# EAGLE design LoRa_RN5 (EAGLE 7.2.0)
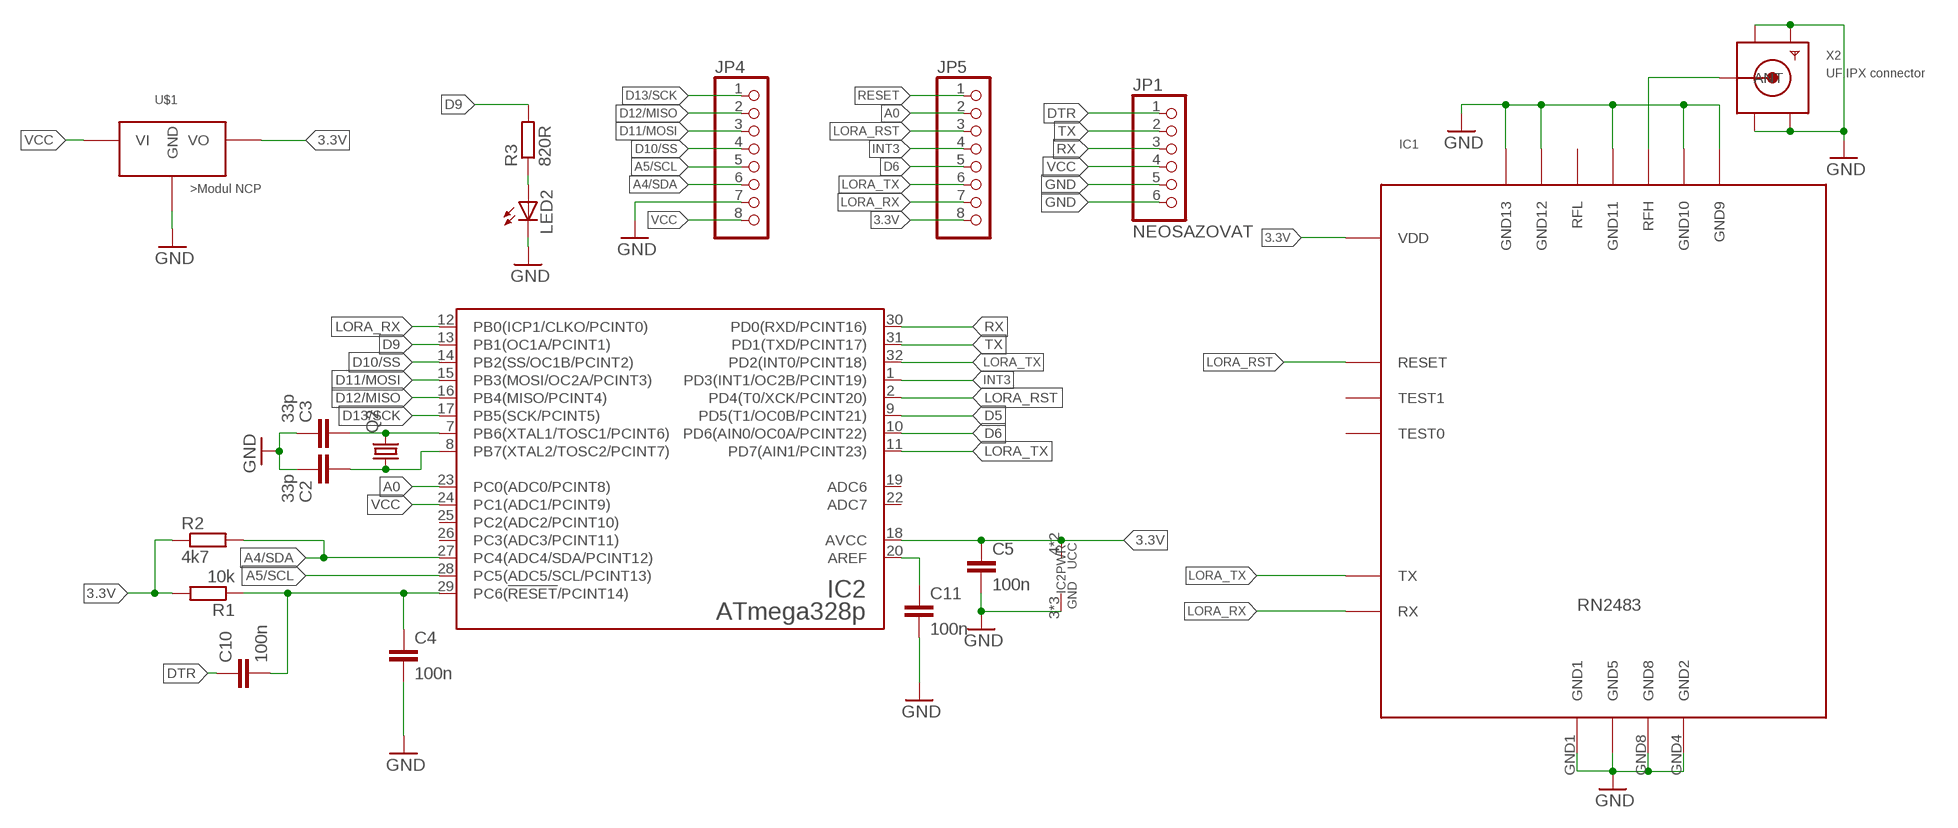
[diagram p0: schematic, sheet 1]

## Parts
C2  33p  C-EUC0805  [C0805]
C3  33p  C-EUC0805  [C0805]
C4  100n  C-EUC0805  [C0805]
C5  100n  C-EUC0805  [C0805]
C10  100n  C-EUC0805  [C0805]
C11  100n  C-EUC0805  [C0805]
IC1  RN2483_MIN  [RN2483_2]
IC2  ATmega328p  ATMEGA48/88/168/328-AU  [TQFP32-08]
JP1  NEOSAZOVAT  PINHD-1X6  [1X06]
JP4  PINHD-1X8  [1X08]
JP5  PINHD-1X8  [1X08]
LED2  LEDCHIPLED_1206  [CHIPLED_1206]
Q2  CRYSTALCTS406  [CTS406]
R1  10k  R-EU_R0805  [R0805]
R2  4k7  R-EU_R0805  [R0805]
R3  820R  R-EU_R0805  [R0805]
U$1  NEOSAZOVAT  MOD_NCP1402  [MOD_NCP1402]
X2  UF.IPX connector  SMACONNECTOR_EDGE_UFL  [SMA_EDGELAUNCH_UFL]

## Nets
3.3V: C5.1 IC1.VDD IC2.4(UCC) IC2.6(UCC) IC2.18(AVCC) JP5.8 R1.2 R2.1 U$1.VO
A0: IC2.23(PC0(ADC0/PCINT8)) JP5.2
A4/SDA: IC2.27(PC4(ADC4/SDA/PCINT12)) JP4.6 R2.2
A5/SCL: IC2.28(PC5(ADC5/SCL/PCINT13)) JP4.5
D5: IC2.9(PD5(T1/OC0B/PCINT21))
D6: IC2.10(PD6(AIN0/OC0A/PCINT22)) JP5.5
D9: IC2.13(PB1(OC1A/PCINT1)) R3.2
D10/SS: IC2.14(PB2(SS/OC1B/PCINT2)) JP4.4
D11/MOSI: IC2.15(PB3(MOSI/OC2A/PCINT3)) JP4.3
D12/MISO: IC2.16(PB4(MISO/PCINT4)) JP4.2
D13/SCK: IC2.17(PB5(SCK/PCINT5)) JP4.1
DTR: C10.1 JP1.1
GND: C2.1 C3.1 C4.2 C5.2 C11.2 IC1.GND1 IC1.GND4(GND2) IC1.GND5 IC1.GND8 IC1.GND9 IC1.GND10 IC1.GND11 IC1.GND12 IC1.GND13 IC2.3(GND) IC2.5(GND) IC2.21(GND) JP1.5 JP1.6 JP4.7 LED2.C U$1.GND X2.GND@1(GND1) X2.GND@2(GND2) X2.GND@3(GND3) X2.GND@4(GND4)
INT3: IC2.1(PD3(INT1/OC2B/PCINT19)) JP5.4
LORA_RST: IC1.RESET IC2.2(PD4(T0/XCK/PCINT20)) JP5.3
LORA_RX: IC1.RX IC2.12(PB0(ICP1/CLKO/PCINT0)) JP5.7
LORA_TX: IC1.TX IC2.11(PD7(AIN1/PCINT23)) IC2.32(PD2(INT0/PCINT18)) JP5.6
N$1: IC1.RFH X2.P(ANT)
N$2: C2.2 IC2.8(PB7(XTAL2/TOSC2/PCINT7)) Q2.1
N$3: C3.2 IC2.7(PB6(XTAL1/TOSC1/PCINT6)) Q2.3
N$4: LED2.A R3.1
N$5: C11.1 IC2.20(AREF)
RESET: C4.1 C10.2 IC2.29(PC6(!RESET!/PCINT14)) JP5.1 R1.1
RX: IC2.30(PD0(RXD/PCINT16)) JP1.3
TX: IC2.31(PD1(TXD/PCINT17)) JP1.2
VCC: IC2.24(PC1(ADC1/PCINT9)) JP1.4 JP4.8 U$1.VI
Unconnected: IC1.RFL IC1.TEST0 IC1.TEST1 IC2.19(ADC6) IC2.22(ADC7) IC2.25(PC2(ADC2/PCINT10)) IC2.26(PC3(ADC3/PCINT11))

## Library data of the parts
C2-C5 C10 C11 = rcl:C-EU: CAPACITOR, European symbol
IC1 = RN2483:RN2483_MIN
IC2 = atmel_tiny24-44-84tiny48-88mega48-88-168-328:ATMEGA48/88/168/328
JP1 = pinhead:PINHD-1X6: PIN HEADER
JP4 JP5 = pinhead:PINHD-1X8: PIN HEADER
LED2 = led:LED: LED OSRAM: - CHIPLED LG R971, LG N971, LY N971, LG Q971, LY Q971, LO R971, LY R971 LH N974, LH R974 LS Q976, LO Q976, LY Q976 LO Q996 - Hyper CHIPLED LW Q18S LB Q993, LB Q99A, LB R99A - SideLED LS A670, LO A670, LY A670, LG A670, LP A670 LB A673, LV A673, LT A673, LW A673 LH A674 LY A675 LS A676, LA A676, LO A676, LY A676, LW A676 LS A679, LY A679, LG A679 - Hyper Micro SIDELED® LS Y876, LA Y876, LO Y876, LY Y876 LT Y87S - SmartLED LW L88C, LW L88S LB L89C, LB L89S, LG L890 LS L89K, LO L89K, LY L89K LS L896, LA L896, LO L896, LY L896 - TOPLED LS T670, LO T670, LY T670, LG T670, LP T670 LSG T670, LSP T670, LSY T670, LOP T670, LYG T670 LG T671, LOG T671, LSG T671 LB T673, LV T673, LT T673, LW T673 LH T674 LS T676, LA T676, LO T676, LY T676, LB T676, LH T676, LSB T676, LW T676 LB T67C, LV T67C, LT T67C, LS T67K, LO T67K, LY T67K, LW E67C LS E67B, LA E67B, LO E67B, LY E67B, LB E67C, LV E67C, LT E67C LW T67C LS T679, LY T679, LG T679 LS T770, LO T770, LY T770, LG T770, LP T770 LB T773, LV T773, LT T773, LW T773 LH T774 LS E675, LA E675, LY E675, LS T675 LS T776, LA T776, LO T776, LY T776, LB T776 LHGB T686 LT T68C, LB T68C - Hyper Mini TOPLED® LB M676 - Mini TOPLED Santana® LG M470 LS M47K, LO M47K, LY M47K Source: http://www.osram.convergy.de LUXEON: - LUMILED® LXK2-PW12-R00, LXK2-PW12-S00, LXK2-PW14-U00, LXK2-PW14-V00 LXK2-PM12-R00, LXK2-PM12-S00, LXK2-PM14-U00 LXK2-PE12-Q00, LXK2-PE12-R00, LXK2-PE12-S00, LXK2-PE14-T00, LXK2-PE14-U00 LXK2-PB12-K00, LXK2-PB12-L00, LXK2-PB12-M00, LXK2-PB14-N00, LXK2-PB14-P00, LXK2-PB14-Q00 LXK2-PR12-L00, LXK2-PR12-M00, LXK2-PR14-Q00, LXK2-PR14-R00 LXK2-PD12-Q00, LXK2-PD12-R00, LXK2-PD12-S00 LXK2-PH12-R00, LXK2-PH12-S00 LXK2-PL12-P00, LXK2-PL12-Q00, LXK2-PL12-R00 Source: www.luxeon.com KINGBRIGHT: KA-3528ASYC Source: www.kingbright.com
Q2 = crystal:CRYSTAL: CRYSTAL; OC_FARNELL: unknown; OC_NEWARK: unknown
R1-R3 = rcl:R-EU_: RESISTOR, European symbol
U$1 = MOJE_NB:MOD_NCP1402
X2 = adafruit:SMACONNECTOR: SMA Connector 90° DIP SMA Connector, 50 Ohm (4UConnector: 07259)

## Board
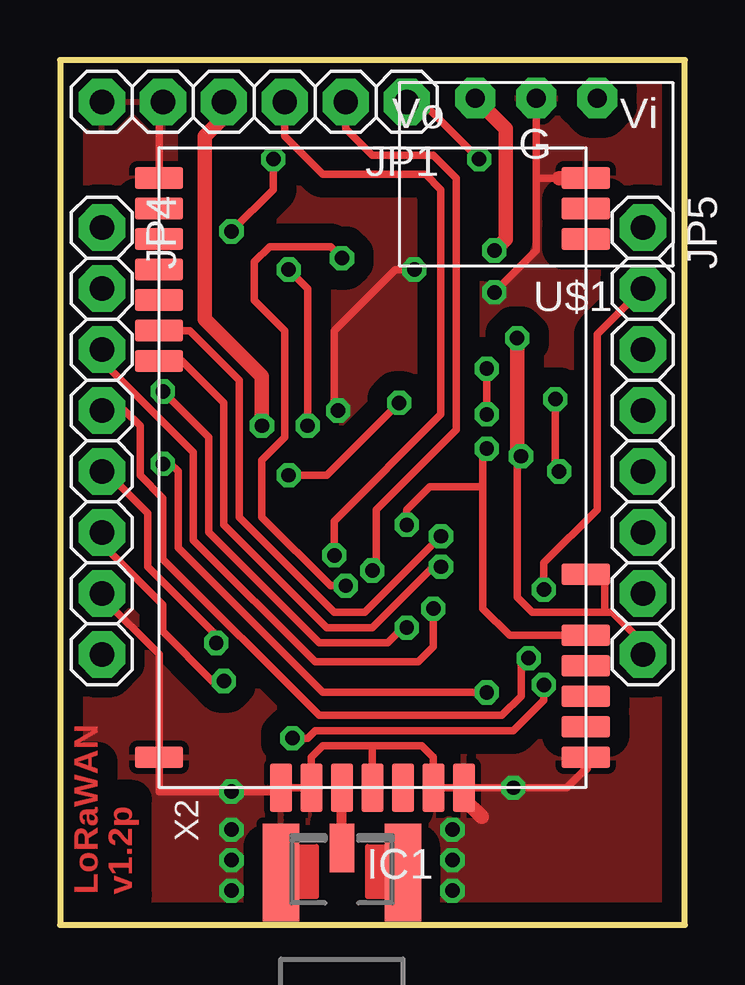
[diagram p1: board, top side]
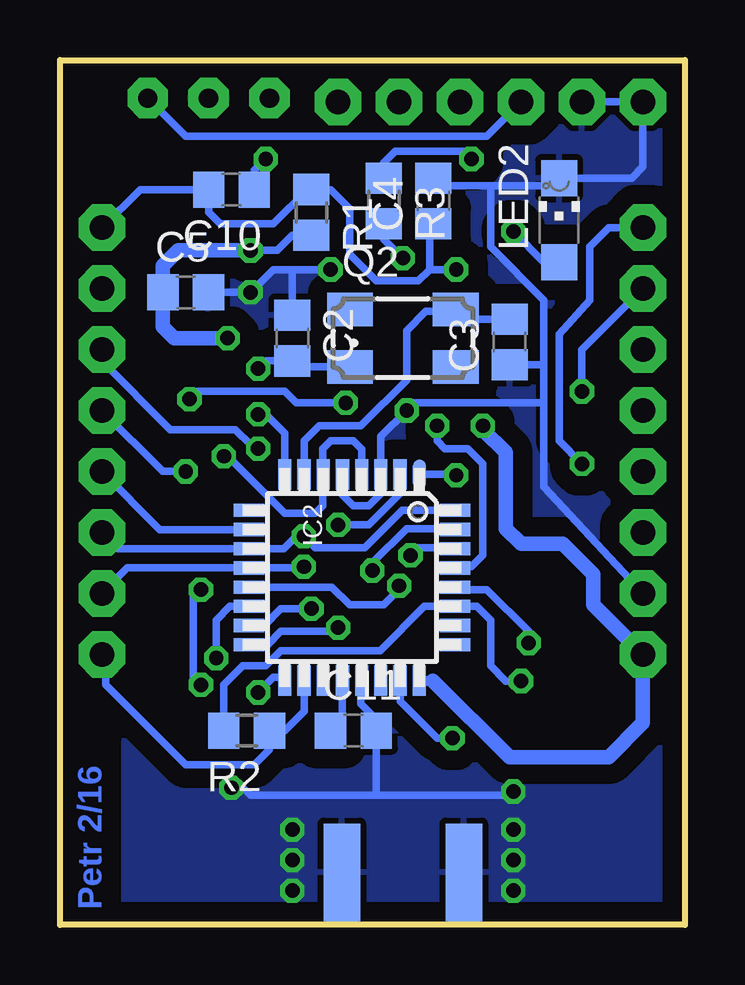
[diagram p2: board, bottom side, seen from below]

Size 26.03 x 36.04 mm. Coordinates in mm from the lower left corner, seen from the top.
Outline: 0,36.04 0,0 26.04,0 26.04,36.04 0,36.04
Copper layers (1*16): Top 0.035mm / dielectric 1.5mm / Bottom 0.035mm
Design rules "default *": minimum track width 6mil, minimum drill 10mil, track to track 6mil, track to pad 6mil, pad to pad 6mil, via to via 6mil, smd to smd 6mil, copper to edge 20mil, drill to drill 6mil, minimum pad ring 10mil, minimum via ring 8mil, stop-mask expansion 4mil, vias tented up to drill 0mil, thermal gap 10mil

### Footprints (pad centres in the part's own frame; a part is rotated, then mirrored left to right if it is on the bottom)
C0805 = smd 1.3 x 1.5: 1 -0.95,0; 2 0.95,0
RN2483_2 = smd 2 x 0.9: CTS 8.89,-10.16; GND1 -8.89,11.43; GND4 -8.89,-12.7; GND5 8.89,-12.7; GND8 8.89,11.43; GPIO8 -8.89,-10.16; GPIO9 -8.89,-11.43; NC1 -8.89,10.16; RESET -8.89,6.35; RSV1 8.89,-8.89; RSV2 8.89,-7.62; RTS 8.89,-11.43; RX 8.89,-5.08; TEST0 -8.89,8.89; TEST1 -8.89,7.62; TX 8.89,-6.35; VDD -8.89,3.81 | smd 0.9 x 2: GND9 3.81,12.7; GND10 2.54,12.7; GND11 0,12.7; GND12 -2.54,12.7; GND13 -3.81,12.7; RFH 1.27,12.7; RFL -1.27,12.7
TQFP32-08 = smd 1.27 x 0.55: 1 -4.293,2.8; 2 -4.293,2; 3 -4.293,1.2; 4 -4.293,0.4; 5 -4.293,-0.4; 6 -4.293,-1.2; 7 -4.293,-2; 8 -4.293,-2.8; 17 4.293,-2.8; 18 4.293,-2; 19 4.293,-1.2; 20 4.293,-0.4; 21 4.293,0.4; 22 4.293,1.2; 23 4.293,2; 24 4.293,2.8 | smd 0.55 x 1.27: 9 -2.8,-4.293; 10 -2,-4.293; 11 -1.2,-4.293; 12 -0.4,-4.293; 13 0.4,-4.293; 14 1.2,-4.293; 15 2,-4.293; 16 2.8,-4.293; 25 2.8,4.293; 26 2,4.293; 27 1.2,4.293; 28 0.4,4.293; 29 -0.4,4.293; 30 -1.2,4.293; 31 -2,4.293; 32 -2.8,4.293
1X06 = drill 1.016 pad 1.93 octagon: 1 -6.35,0; 2 -3.81,0; 3 -1.27,0; 4 1.27,0; 5 3.81,0; 6 6.35,0
1X08 = drill 1.016 pad 1.93 octagon: 1 -8.89,0; 2 -6.35,0; 3 -3.81,0; 4 -1.27,0; 5 1.27,0; 6 3.81,0; 7 6.35,0; 8 8.89,0
CHIPLED_1206 = smd 1.5 x 1.5: A 0,-1.75; C 0,1.75
CTS406 = smd 1.9 x 1.4: 1 -2.2,-1.2; 2 2.2,-1.2; 3 2.2,1.2; 4 -2.2,1.2
R0805 = smd 1.3 x 1.5: 1 -0.95,0; 2 0.95,0
MOD_NCP1402 = drill 0.8 pad 1.676 octagon: GND 0,0; VI -2.54,0; VO 2.54,0
SMA_EDGELAUNCH_UFL = smd 4.064 x 1.524: GND@1 2.032,-2.54; GND@2 2.032,2.54 | smd 4.064 x 1.524 bottom: GND@3 2.032,2.54; GND@4 2.032,-2.54 | smd 2.032 x 1.016: P 3.048,0

### Placement (x,y rotation side)
C2  16.35,24.45 270 bottom
C3  7.3,24.29 90 bottom
C4  10.48,30.16 90 bottom
C5  20.8,26.35 0 bottom
C10  18.89,30.64 180 bottom
C11  13.81,8.1 0 bottom
IC1  13.02,18.41 180 top
IC2  13.87,14.47 270 bottom
JP1  8.1,34.29 180 top
JP4  1.75,20.16 270 top
JP5  24.29,20.16 270 top
LED2  5.24,29.37 0 bottom
Q2  11.75,24.45 0 bottom
R1  15.56,29.69 270 bottom
R2  18.26,8.1 180 bottom
R3  12.54,30.16 270 bottom
U$1  19.84,34.45 180 top
X2  11.75,0.16 90 top

### Tracks (layer width: path | path; a pad name or v marks a point on that pad's centre or on a via)
3.3V  (via drill 0.6)
  Top 0.305: IC1.VDD 21.91,14.29 22.54,14.29 22.7,14.45 22.7,13.02 | JP5.8 24.29,11.75 23.02,13.02 22.7,13.02 | 22.7,13.02 19.69,13.02 19.05,13.65 19.05,19.37 v19.21,19.53
  Top 0.61: v19.05,24.45 19.05,19.68 v19.21,19.53 | U$1.VO 18.57,33.18 18.57,28.57 v18.1,28.1
  Bottom 0.305: JP5.8 24.13,11.11 24.13,10 20.8,6.67 17.94,6.67 17.31,7.3 R2.1 16.67,8.1 15.87,8.9 IC2.18 | R1.2 16.35,28.74 16.99,28.1 v18.1,28.1 | IC2.4 13.47,19.82 13.81,20.16 14.76,20.16 15.08,19.84 15.08,18.78 IC2.6 15.08,18.75 15.08,17.46 15.4,17.14 16.67,17.14 18.73,19.21 19.05,19.53 v19.21,19.53 | C5.1
  Bottom 0.61: v18.1,28.1 21.11,28.1 21.75,27.46 C5.1 | v19.05,24.45 21.27,24.45 21.75,24.92 C5.1
A0  (via drill 0.6)
  Top 0.305: v20.16,10 20.16,9.37 18.89,8.1 10.64,8.1 10.32,7.78 v9.68,7.78 | v20.16,13.97 20.16,15.08 22.38,17.3 22.38,24.61 JP5.2
  Bottom 0.305: IC2.23 11.87,9.33 10.32,7.78 v9.68,7.78 | v20.16,10 20.48,10.32 20.48,13.65 v20.16,13.97
A4/SDA  (via drill 0.6)
  Top 0.305: JP4.6 1.75,15.87 4.29,13.33 4.29,12.22 6.35,10.16 v6.83,10.16
  Bottom 0.305: R2.2 19.21,8.42 19.21,10 18.42,10.79 17.46,10.79 16.83,11.43 12.7,11.43 10.86,13.27 IC2.27 8.67,13.27 8.1,12.7 8.1,10.79 7.46,10.16 v6.83,10.16
A5/SCL  (via drill 0.6)
  Top 0.305: JP4.5 1.91,18.89 3.65,17.14 3.65,14.92 6.51,12.06 v6.51,11.75
  Bottom 0.305: IC2.28 9.47,13.97 8.26,13.97 6.51,12.22 v6.51,11.75
D6
  Bottom 0.305: IC2.10 21.87,16.47 JP5.5
D9  (via drill 0.6)
  Top 0.305: v11.91,14.13 11.27,14.13 8.41,16.99 8.41,19.37 9.37,20.32 9.37,24.76 8.1,26.03 8.1,27.62 8.73,28.26 11.27,28.26 v11.75,27.78
  Bottom 0.305: R3.2 12.54,28.57 v11.75,27.78 | v11.91,14.13 11.96,14.07 11.96,13.91 12.54,13.33 13.97,13.33 14.71,14.07 IC2.13
D10/SS  (via drill 0.6)
  Top 0.305: v19.53,11.11 19.21,10.79 19.21,9.52 18.42,8.73 10.8,8.73 4.29,15.24 4.29,17.78 3.33,18.73 3.33,20.8 2.7,21.43 JP4.4
  Bottom 0.305: IC2.14 18.95,13.27 19.53,12.7 v19.53,11.11 19.46,11.21
D11/MOSI  (via drill 0.6)
  Top 0.305: v15.56,13.18 15.56,11.59 14.92,10.95 10.64,10.95 5.56,16.03 5.56,19.68 1.75,23.49 JP4.3
  Bottom 0.305: IC2.15 17.53,12.47 16.83,13.18 v15.56,13.18
D12/MISO  (via drill 0.6)
  Top 0.305: v14.45,12.38 14.29,12.38 13.65,11.75 10.8,11.75 6.19,16.35 6.19,20.32 v4.29,22.22
  Bottom 0.305: IC2.16 17.38,11.67 16.83,12.22 14.61,12.22 v14.45,12.38 | v4.29,22.22 4.29,23.97 JP4.2
D13/SCK  (via drill 0.6)
  Top 0.305: v17.78,9.68 10.95,9.68 4.92,15.72 4.92,18.89 4.6,19.21 v4.29,19.21
  Bottom 0.305: IC2.17 16.67,10.32 | 16.67,10.32 | 16.67,10.32 17.15,10.32 v17.78,9.68 | JP4.1 3.18,29.05 3.97,28.26 3.97,26.03 5.24,24.61 5.24,20.16 v4.29,19.21
DTR  (via drill 0.6)
  Top 0.305: JP1.1 15.08,34.29 v17.46,31.91
  Bottom 0.305: v17.46,31.91 17.94,31.43 C10.1
GND  (via drill 0.6)
  Top 0.305: 21.91,6.51 21.11,5.71 v18.89,5.71 IC1.GND13 IC1.GND12 15.56,6.98 15.08,7.46 13.02,7.46 | v14.76,27.3 13.97,27.3 11.43,24.76 11.43,21.59 v11.59,21.43 | IC1.GND11 13.02,7.46 | 13.02,7.46 10.95,7.46 10.48,6.98 IC1.GND10 IC1.GND9 9.05,5.56 v7.14,5.56 4.13,5.56 4.13,7.14 | U$1.GND 19.84,31.11 | 19.84,31.11 19.84,28.1 v18.1,26.35 | IC1.GND5 4.13,34.13 JP1.5 | JP4.7 1.75,13.65 4.13,11.27 4.13,7.14 | 4.13,7.14 4.29,7.14 IC1.GND8 | 20.8,31.11 19.84,31.11
  Top 0.406: 21.91,6.51 IC1.GND1 | IC1.GND11 13.12,5.71
  Top 0.61: 17.57,4.5 16.83,5.24 IC1.GND13 | 10.48,5.08 IC1.GND10 | IC1.GND4 20.8,31.11
  Bottom 0.305: 5.87,21.75 5.87,23.34 | 5.87,23.34 5.87,26.03 8.1,28.26 8.1,30.8 | IC2.21 13.49,10.15 13.49,9.21 12.86,8.57 C11.2 12.86,6.19 12.86,5.4 | C5.2 18.26,26.35 18.1,26.51 v18.1,26.35 17.15,27.3 16.35,27.3 | 8.1,30.8 9.84,30.8 C4.2 | IC2.5 14.27,17.92 13.81,17.46 13.18,17.46 12.7,17.94 12.7,18.73 IC2.3 12.67,20.35 v11.59,21.43 11.27,21.75 5.87,21.75 | 5.87,21.75 5.87,18.26 JP4.7 | 12.86,5.4 7.3,5.4 v7.14,5.56 | v18.89,5.71 18.42,5.71 18.1,5.4 12.86,5.4 | JP1.5 JP1.6 1.75,31.59 2.22,31.12 LED2.C 5.72,30.8 8.1,30.8 | v14.76,27.3 16.35,27.3 | C3.1 6.19,23.34 5.87,23.34 | C2.1 16.35,27.3
  other vias: 7.14,3.97 7.14,2.7 7.14,1.43 16.35,1.43 16.35,2.7 16.35,3.97
  pour Bottom (isolate 0.813): -0.48,36.35 26.35,36.35 26.35,-0.32 -0.48,-0.32
  pour Top (isolate 0.813): -0.48,36.51 26.51,36.51 26.51,-0.32 -0.48,-0.32
INT3  (via drill 0.6)
  Top 0.305: v9.53,18.73 11.11,18.73 v14.13,21.75 | v20.64,21.91 20.64,19.05 v20.8,18.89
  Bottom 0.305: JP5.4 21.75,18.89 v20.8,18.89 | v14.13,21.75 16.19,21.75 16.67,22.22 20.32,22.22 v20.64,21.91 | IC2.1 9.56,18.77 v9.53,18.73
LORA_RST  (via drill 0.6)
  Top 0.305: v14.45,16.67 14.45,17.3 15.4,18.26 17.62,18.26 | 17.62,18.26 17.62,13.18 18.73,12.06 IC1.RESET | v17.78,19.84 17.62,19.68 17.62,18.26
  Bottom 0.305: JP5.3 24.29,23.49 21.43,20.64 18.73,20.64 18.1,20 17.78,20 v17.78,19.84 | IC2.2 11.87,17.98 13.18,16.67 v14.45,16.67
LORA_RX  (via drill 0.6)
  Top 0.305: IC1.RX 5.08,23.49 6.83,21.75 6.83,16.67 11.11,12.38 13.02,12.38 15.56,14.92 v15.88,14.92
  Bottom 0.305: JP5.7 23.23,14.87 IC2.12 15.92,14.87 v15.88,14.92
LORA_TX  (via drill 0.6)
  Top 0.305: IC1.TX 5.4,24.76 7.46,22.7 7.46,16.99 11.43,13.02 12.7,13.02 v15.88,16.19
  Bottom 0.305: JP5.6 23.61,15.67 IC2.11 16.71,15.67 16.19,16.19 v15.88,16.19 15.4,15.72 13.34,15.72 11.78,17.27 IC2.32
N$1
  Top 0.406: X2.P IC1.RFH
N$2  (via drill 0.6)
  Top 0.305: v17.78,21.27 v17.78,23.18
  Bottom 0.305: Q2.1 16.1,23.25 C2.2 | 16.67,23.02 C2.2 | IC2.8 16.67,20.32 16.67,20.48 17.46,21.27 v17.78,21.27 | v17.78,23.18 17.46,23.49 C2.2
N$3
  Bottom 0.305: C3.2 9.3,25.24 Q2.3 9.62,25.56 10.8,25.56 11.59,24.76 11.59,22.7 13.49,20.8 15.24,20.8 15.87,20.17 IC2.7
N$4  (via drill 0.6)
  Top 0.305: v7.14,28.89 8.89,30.64 v8.89,31.91
  Bottom 0.305: LED2.A 5.87,27.62 v7.14,28.89 | v8.89,31.91 8.89,32.07 9.05,32.23 12.07,32.23 12.54,31.75 R3.1
N$5
  Bottom 0.305: IC2.20 14.27,8.59 C11.1
RESET  (via drill 0.6)
  Top 0.305: v10.32,20.8 10.32,26.51 v9.53,27.3
  Bottom 0.305: JP5.1 22.7,30.64 C10.2 19.84,29.69 19.37,29.21 17.15,29.21 15.72,30.64 R1.1 14.76,30.64 13.97,29.84 13.97,27.94 12.86,26.83 11.11,26.83 10.64,27.3 | 10,28.74 C4.1 10.48,29.05 10.64,28.89 10.64,27.3 | v9.53,27.3 10.64,27.3 | IC2.29 9.52,14.92 8.89,14.92 8.41,15.4 8.41,19.21 9.05,19.84 10,19.84 10.32,20.16 v10.32,20.8
RX  (via drill 0.6)
  Top 0.305: v11.43,15.4 11.43,16.83 15.88,21.27 15.88,30.64 15.24,31.27 10.95,31.27 9.37,32.86 JP1.3
  Bottom 0.305: v11.43,15.4 11.11,15.72 9.62,15.72 IC2.30
TX  (via drill 0.6)
  Top 0.305: v13.02,14.76 13.02,14.92 13.18,15.08 13.18,17.3 16.51,20.64 16.51,31.11 15.56,32.07 13.02,32.07 11.91,33.18 JP1.2
  Bottom 0.305: IC2.31 9.61,16.51 11.59,16.51 13.02,15.08 v13.02,14.76
VCC  (via drill 0.6)
  Top 0.61: JP1.4 7.14,33.97 6.03,32.86 6.03,25.24 8.41,22.86 v8.41,20.8
  Bottom 0.305: JP1.4 8.26,32.86 20.8,32.86 U$1.VI
  Bottom 0.406: IC2.24 10.5,10.18
  Bottom 0.61: 10.5,10.18 7.3,6.98 3.18,6.98 1.75,8.41 JP4.8 3.81,13.33 3.81,14.6 5.08,15.87 6.83,15.87 7.46,16.51 7.46,19.68 8.41,20.64 v8.41,20.8

### Text on the board
Top: LoRaWAN | v1.2p
Bottom: Petr 2/16